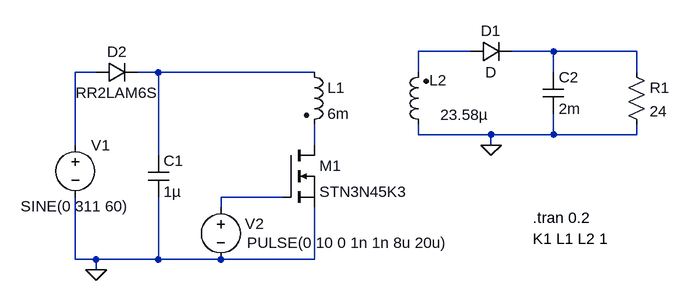
[diagram p0: schematic parte1.asc]
parte1.asc, the LTspice schematic file:
Version 4
SHEET 1 904 680
WIRE 368 -272 288 -272
WIRE 496 -272 432 -272
WIRE 624 -272 496 -272
WIRE -208 -240 -240 -240
WIRE -112 -240 -144 -240
WIRE 128 -240 -112 -240
WIRE 288 -240 288 -272
WIRE 496 -240 496 -272
WIRE 624 -240 624 -272
WIRE 288 -144 288 -160
WIRE 400 -144 288 -144
WIRE 496 -144 496 -176
WIRE 496 -144 400 -144
WIRE 624 -144 624 -160
WIRE 624 -144 496 -144
WIRE -240 -128 -240 -240
WIRE 128 -128 128 -160
WIRE 400 -128 400 -144
WIRE -112 -112 -112 -240
WIRE 80 -48 -16 -48
WIRE -16 -32 -16 -48
WIRE -240 48 -240 -48
WIRE -208 48 -240 48
WIRE -112 48 -112 -48
WIRE -112 48 -208 48
WIRE -16 48 -112 48
WIRE 128 48 128 -32
WIRE 128 48 -16 48
WIRE -208 64 -208 48
FLAG -208 64 0
FLAG 400 -128 0
SYMBOL voltage -240 -144 R0
WINDOW 3 -84 110 Left 2
WINDOW 123 0 0 Left 0
WINDOW 39 0 0 Left 0
SYMATTR Value SINE(0 311 60)
SYMATTR InstName V1
SYMBOL voltage -16 -48 R0
WINDOW 0 37 41 Left 2
WINDOW 3 40 70 Left 2
WINDOW 123 0 0 Left 0
WINDOW 39 0 0 Left 0
SYMATTR InstName V2
SYMATTR Value PULSE(0 10 0 1n 1n 8u 20u)
SYMBOL diode 368 -256 R270
WINDOW 0 32 32 VTop 2
WINDOW 3 0 32 VBottom 2
SYMATTR InstName D1
SYMBOL res 608 -256 R0
SYMATTR InstName R1
SYMATTR Value 24
SYMBOL cap 480 -240 R0
SYMATTR InstName C2
SYMATTR Value 2m
SYMBOL ind2 112 -256 R0
SYMATTR InstName L1
SYMATTR Value 6m
SYMBOL ind2 304 -144 R180
WINDOW 0 -28 84 Left 2
WINDOW 3 -92 31 Left 2
SYMATTR InstName L2
SYMATTR Value 23.58µ
SYMBOL nmos 80 -128 R0
SYMATTR InstName M1
SYMATTR Value STN3N45K3
SYMBOL cap -128 -112 R0
SYMATTR InstName C1
SYMATTR Value 1µ
SYMBOL diode -208 -224 R270
WINDOW 0 32 32 VTop 2
WINDOW 3 0 32 VBottom 2
SYMATTR InstName D2
SYMATTR Value RR2LAM6S
TEXT 464 -16 Left 2 !.tran 0.2
TEXT 464 16 Left 2 !K1 L1 L2 1

The netlist it stands for:
* parte1.asc
V1 N003 0 SINE(0 311 60)
V2 N006 0 PULSE(0 10 0 1n 1n 8u 20u)
D1 N001 N002 D
R1 N002 0 24
C2 N002 0 2m
L1 N004 N005 6m
L2 0 N001 23.58µ
M1 N005 N006 0 0 STN3N45K3
C1 N004 0 1µ
D2 N003 N004 RR2LAM6S
.model D D
.lib standard.dio
.model NMOS NMOS
.model PMOS PMOS
.lib standard.mos
.tran 0.2
K1 L1 L2 1
.backanno
.end